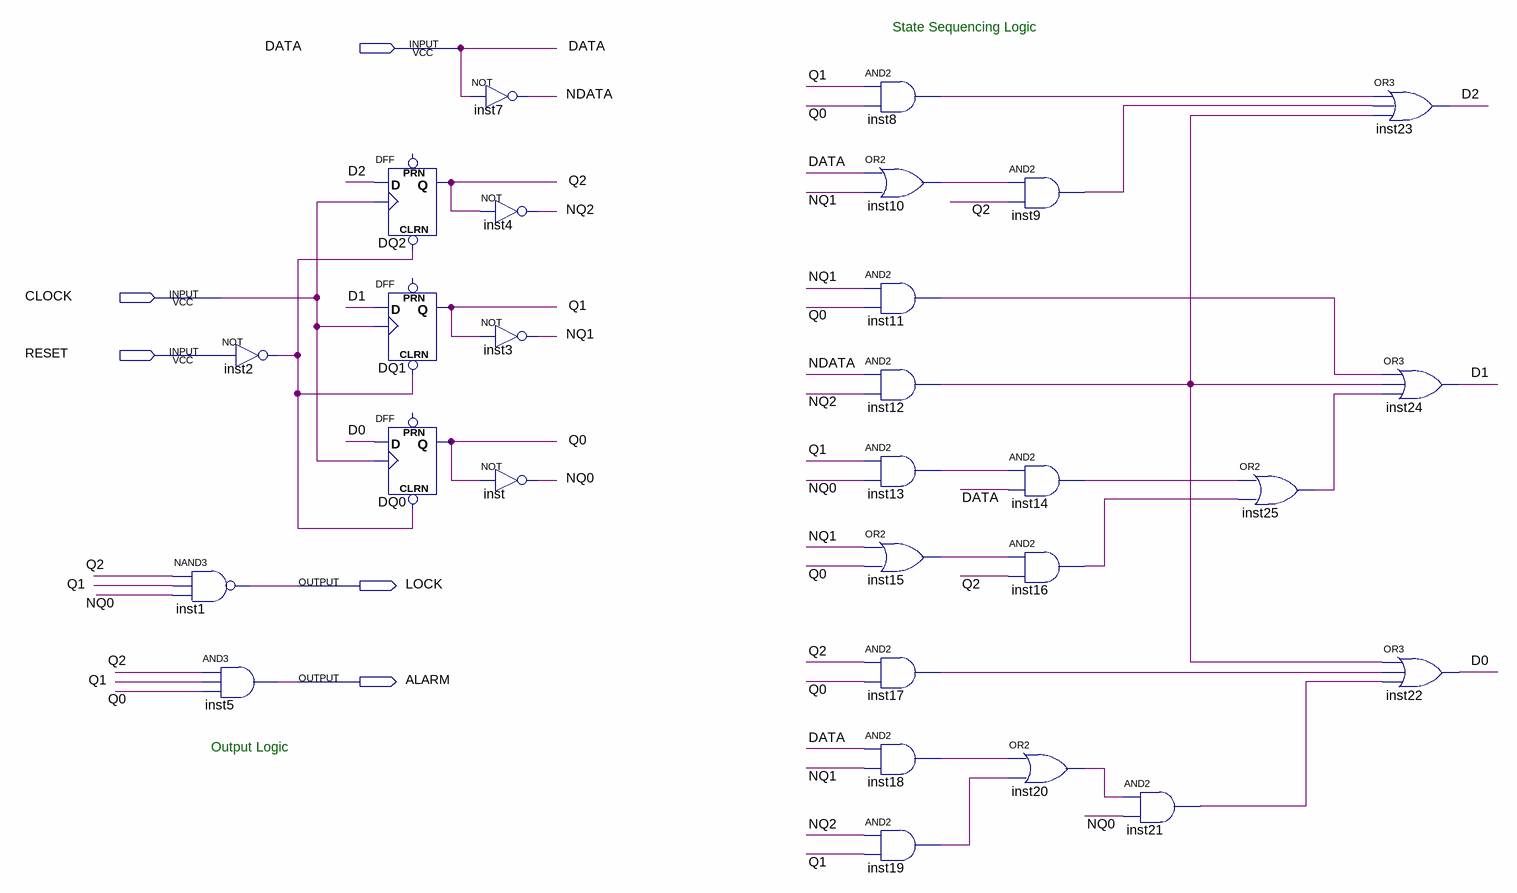
[diagram p0: schematic sheet]
// Quartus schematic dlock.bdf as structural Verilog: 28 symbols, 5 pins
module dlock (
  input  DATA,
  input  CLOCK,
  input  RESET,
  output LOCK,
  output ALARM
);

  wire D0, D1, D2, inst2_out, inst8_out, inst9_out, inst10_out, inst11_out, inst12_out, inst13_out,
       inst14_out, inst15_out, inst16_out, inst17_out, inst18_out, inst19_out, inst20_out, inst21_out,
       inst25_out, NDATA, NQ0, NQ1, NQ2, Q0, Q1, Q2;

  nand inst1 (LOCK, Q2, Q1, NQ0);
  and inst5 (ALARM, Q2, Q1, Q0);
  not inst2 (inst2_out, RESET);
  DFF DQ2 (.CLRN(inst2_out), .CLK(CLOCK), .D(D2), .Q(Q2));  // open: PRN
  DFF DQ1 (.CLRN(inst2_out), .CLK(CLOCK), .D(D1), .Q(Q1));  // open: PRN
  DFF DQ0 (.CLRN(inst2_out), .CLK(CLOCK), .D(D0), .Q(Q0));  // open: PRN
  not inst7 (NDATA, DATA);
  not inst4 (NQ2, Q2);
  not inst3 (NQ1, Q1);
  not inst (NQ0, Q0);
  and inst8 (inst8_out, Q1, Q0);
  or inst10 (inst10_out, DATA, NQ1);
  and inst11 (inst11_out, NQ1, Q0);
  and inst12 (inst12_out, NDATA, NQ2);
  and inst13 (inst13_out, Q1, NQ0);
  or inst15 (inst15_out, NQ1, Q0);
  and inst17 (inst17_out, Q2, Q0);
  and inst18 (inst18_out, DATA, NQ1);
  and inst19 (inst19_out, NQ2, Q1);
  and inst9 (inst9_out, inst10_out, Q2);
  and inst14 (inst14_out, inst13_out, DATA);
  and inst16 (inst16_out, inst15_out, Q2);
  or inst20 (inst20_out, inst18_out, inst19_out);
  and inst21 (inst21_out, inst20_out, NQ0);
  or inst25 (inst25_out, inst14_out, inst16_out);
  or inst23 (D2, inst8_out, inst9_out, inst12_out);
  or inst24 (D1, inst11_out, inst12_out, inst25_out);
  or inst22 (D0, inst12_out, inst17_out, inst21_out);

  // Notes on the sheet:
  //   State Sequencing Logic
  //   Output Logic
endmodule
